# Altium schematic sheet MotorControl.SchDoc
size A; SheetNumber: 1; SheetTotal: 1
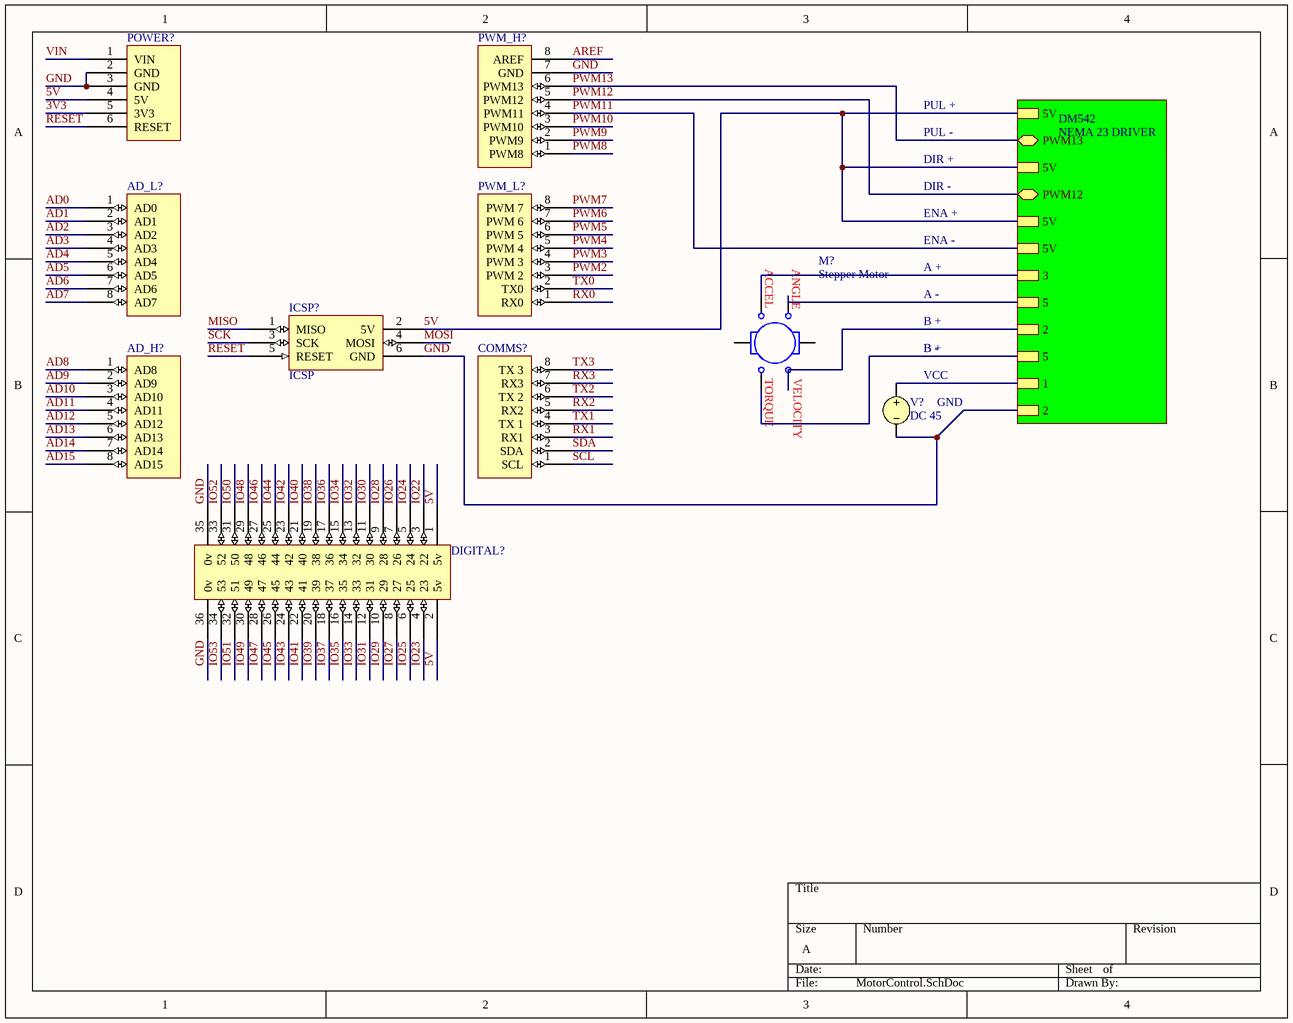
[diagram p0: MotorControl.SchDoc]

## Parts
AD_H?  AD_H  [Header 8x1 8.5mm]  (value not drawn)
AD_L?  AD_L  [Header 8x1 8.5mm]  (value not drawn)
COMMS?  Communication  [Header 8x1 8.5mm]  (value not drawn)
DIGITAL?  IO_36  [HEADER 36X 8MM]  (value not drawn)
ICSP?  ICSP  [ICSP]
M?  Stepper Motor
POWER?  POWER  [Header 6x1 8.5mm]  (value not drawn)
PWM_H?  PWM_H  [Header 8x1 8.5mm]  (value not drawn)
PWM_L?  PWM_L  [Header 8x1 8.5mm]  (value not drawn)
V?  DC 45

## Sub-sheets
DM542 = NEMA 23 DRIVER: 5V, 5V, 5V, PWM13 (bidir), PWM12 (bidir), 5V, 3, 5, 2, 5, 1, 2

## Nets
3V3: POWER?.5(3V3)
5V: DIGITAL?.1(5v) DIGITAL?.2(5v) ICSP?.2(5V) POWER?.4(5V) ; sheet DM542/5V, sheet DM542/5V, sheet DM542/5V
AD0: AD_L?.1(AD0)
AD1: AD_L?.2(AD1)
AD2: AD_L?.3(AD2)
AD3: AD_L?.4(AD3)
AD4: AD_L?.5(AD4)
AD5: AD_L?.6(AD5)
AD6: AD_L?.7(AD6)
AD7: AD_L?.8(AD7)
AD8: AD_H?.1(AD8)
AD9: AD_H?.2(AD9)
AD10: AD_H?.3(AD10)
AD11: AD_H?.4(AD11)
AD12: AD_H?.5(AD12)
AD13: AD_H?.6(AD13)
AD14: AD_H?.7(AD14)
AD15: AD_H?.8(AD15)
AREF: PWM_H?.8(AREF)
GND: DIGITAL?.35(0v) DIGITAL?.36(0v) ICSP?.6(GND) POWER?.2(GND) POWER?.3(GND) PWM_H?.7(GND) V?.2 ; sheet DM542/2
IO22: DIGITAL?.3(22)
IO23: DIGITAL?.4(23)
IO24: DIGITAL?.5(24)
IO25: DIGITAL?.6(25)
IO26: DIGITAL?.7(26)
IO27: DIGITAL?.8(27)
IO28: DIGITAL?.9(28)
IO29: DIGITAL?.10(29)
IO30: DIGITAL?.11(30)
IO31: DIGITAL?.12(31)
IO32: DIGITAL?.13(32)
IO33: DIGITAL?.14(33)
IO34: DIGITAL?.15(34)
IO35: DIGITAL?.16(35)
IO36: DIGITAL?.17(36)
IO37: DIGITAL?.18(37)
IO38: DIGITAL?.19(38)
IO39: DIGITAL?.20(39)
IO40: DIGITAL?.21(40)
IO41: DIGITAL?.22(41)
IO42: DIGITAL?.23(42)
IO43: DIGITAL?.24(43)
IO44: DIGITAL?.25(44)
IO45: DIGITAL?.26(45)
IO46: DIGITAL?.27(46)
IO47: DIGITAL?.28(47)
IO48: DIGITAL?.29(48)
IO49: DIGITAL?.30(49)
IO50: DIGITAL?.31(50)
IO51: DIGITAL?.32(51)
IO52: DIGITAL?.33(52)
IO53: DIGITAL?.34(53)
MISO: ICSP?.1(MISO)
MOSI: ICSP?.4(MOSI)
PWM2: PWM_L?.3(PWM_2)
PWM3: PWM_L?.4(PWM_3)
PWM4: PWM_L?.5(PWM_4)
PWM5: PWM_L?.6(PWM_5)
PWM6: PWM_L?.7(PWM_6)
PWM7: PWM_L?.8(PWM_7)
PWM8: PWM_H?.1(PWM8)
PWM9: PWM_H?.2(PWM9)
PWM10: PWM_H?.3(PWM10)
PWM11: PWM_H?.4(PWM11) ; sheet DM542/5V
PWM12: PWM_H?.5(PWM12) ; sheet DM542/PWM12
PWM13: PWM_H?.6(PWM13) ; sheet DM542/PWM13
RESET: ICSP?.5(RESET) POWER?.6(RESET)
RX0: PWM_L?.1(RX0)
RX1: COMMS?.3(RX1)
RX2: COMMS?.5(RX2)
RX3: COMMS?.7(RX3)
SCK: ICSP?.3(SCK)
SCL: COMMS?.1(SCL)
SDA: COMMS?.2(SDA)
TX0: PWM_L?.2(TX0)
TX1: COMMS?.4(TX_1)
TX2: COMMS?.6(TX_2)
TX3: COMMS?.8(TX_3)
VIN: POWER?.1(VIN)
NetM?_3: M?.3 ; sheet DM542/2
NetM?_4: M?.4 ; sheet DM542/5
NetM?_5: M?.5 ; sheet DM542/5
NetM?_6: M?.6 ; sheet DM542/3
NetV?_1: V?.1 ; sheet DM542/1

Not connected (* = marked no-connect by the designer): M? 1 2

## Notes on the sheet
- PUL +
- PUL -
- DIR +
- DIR -
- ENA +
- ENA -
- A +
- A -
- B +
- (near V?) B +
- (near V?) B -
- (near V?) VCC
- (near V?) GND
- (in symbol Stepper Motor) ACCEL; ANGLE; TORQUE; VELOCITY

## Library data of the parts
M? = Stepper Motor: K: .004545; KD: 120E-9; RS: 227; LS: 55MH; STEP_ANGLE: 18; TD: 1E-6; JMOTOR: 3.5E-9; JLOAD: 0; LIMIT: 5; HARDNESS: 0.1; SimulationGenericComponent: True; TLOAD: 0
V? = VSRC: Voltage Source; Note: PCB Footprint - Not required; AC Magnitude: 1; AC Phase: 0; Value: 5; Published: 8-Jun-2000; LatestRevisionDate: 17-Jul-2002; LatestRevisionNote: Re-released for DXP Platform.; PackageReference: Not Applicable; Publisher: Altium Limited